# EAGLE schematic switch (EAGLE 6.5.0)
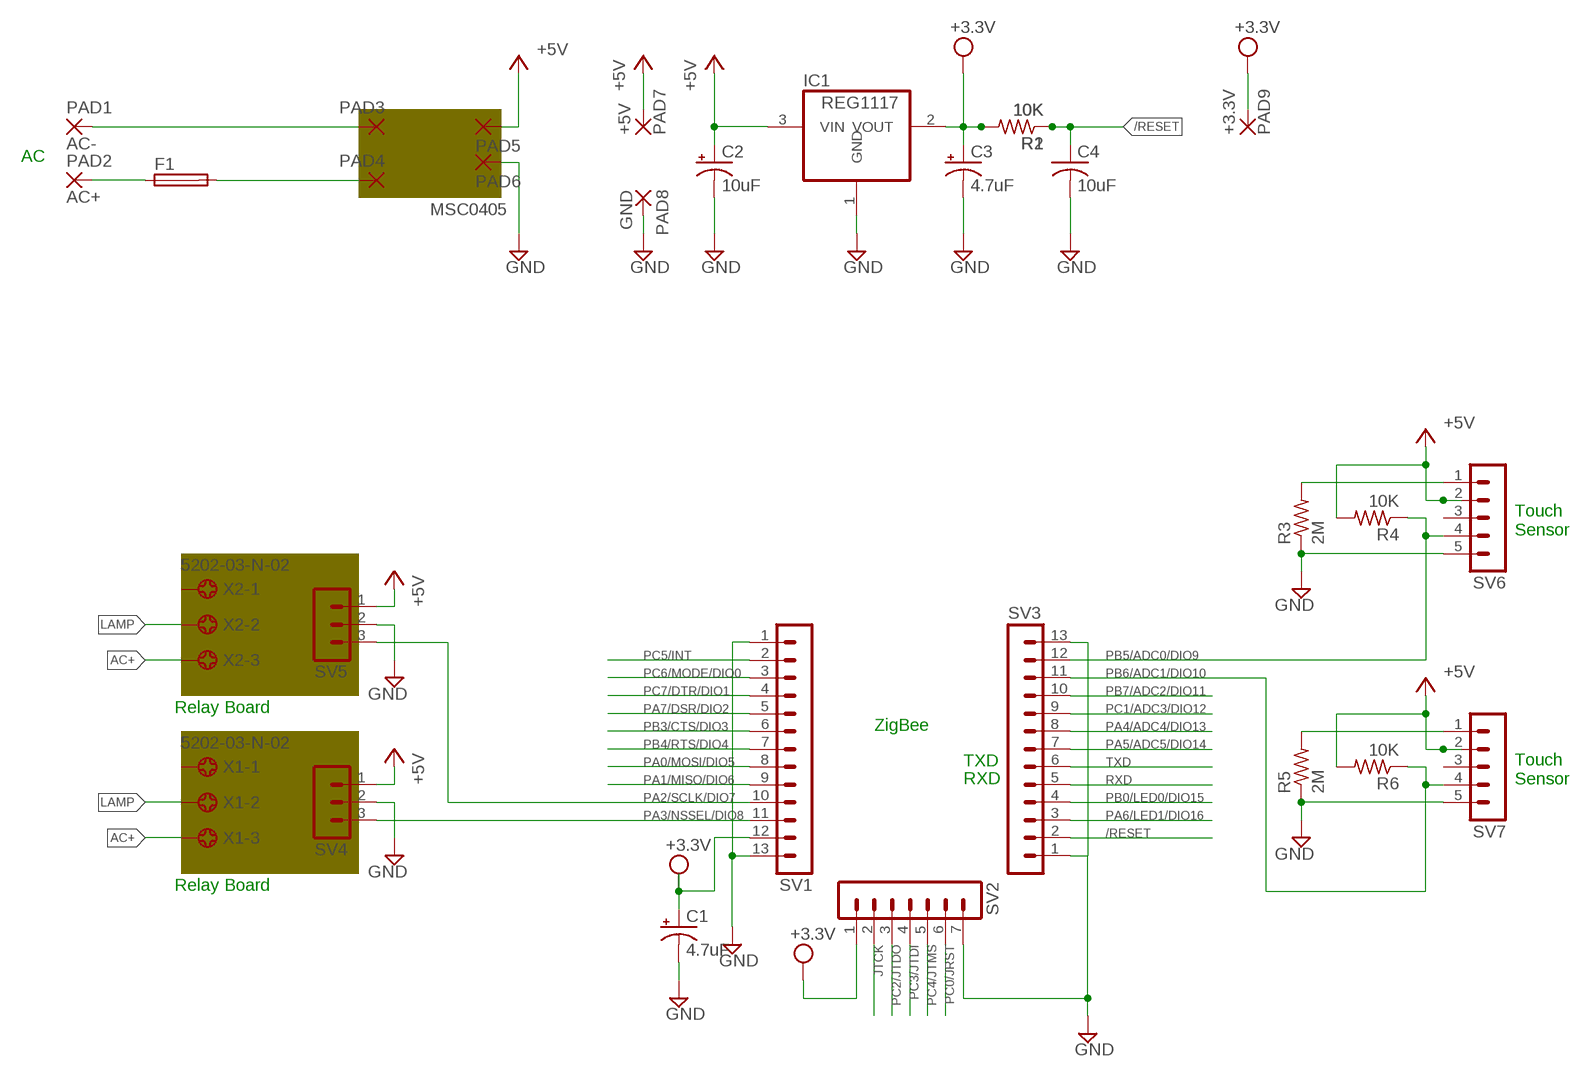
[diagram p0: schematic, sheet 1]

## Parts
C1  4.7uF  CPOL-USSANYO_SMD_A5  [SANYO-OSCON_SMD_A5]
C2  10uF  CPOL-USSANYO_SMD_A5  [SANYO-OSCON_SMD_A5]
C3  4.7uF  CPOL-USSANYO_SMD_A5  [SANYO-OSCON_SMD_A5]
C4  10uF  C-USC1206  [C1206]
F1  GSH15  [GSH15]
IC1  REG1117  [SOT223]
PAD1  AC-  2,54/1,0  [2,54/1,0]
PAD2  AC+  2,54/1,0  [2,54/1,0]
PAD3  2,54/0,8  [2,54/0,8]
PAD4  2,54/0,8  [2,54/0,8]
PAD5  2,54/0,8  [2,54/0,8]
PAD6  2,54/0,8  [2,54/0,8]
PAD7  +5V  2,54/0,8  [2,54/0,8]
PAD8  GND  2,54/0,8  [2,54/0,8]
PAD9  +3.3V  2,54/0,8  [2,54/0,8]
R1  10K  R-US_M1206  [M1206]
R2  10K  R-US_M1206  [M1206]
R3  2M  R-US_M1206  [M1206]
R4  10K  R-US_M1206  [M1206]
R5  2M  R-US_M1206  [M1206]
R6  10K  R-US_M1206  [M1206]
SV1  MA13-1  [MA13-1]
SV2  MA07-1  [MA07-1]
SV3  MA13-1  [MA13-1]
SV4  MA03-1  [MA03-1]
SV5  MA03-1  [MA03-1]
SV6  MA05-1  [MA05-1]
SV7  MA05-1  [MA05-1]
X1  5202-03-N-02  [5202-03-N-02]
X2  5202-03-N-02  [5202-03-N-02]

## Nets
+5V: C2.+ IC1.3(VIN) PAD5.1(P) PAD7.1(P) R4.2 R6.2 SV4.1 SV5.1 SV6.2 SV7.2
/RESET: C4.1 R1.1 R2.1 SV3.2
AC+: X1.3 X2.3
GND: C1.- C2.- C3.- C4.2 IC1.1(GND) PAD6.1(P) PAD8.1(P) R3.1 R5.1 SV1.1 SV1.13 SV2.7 SV3.1 SV3.13 SV4.2 SV5.2 SV6.5 SV7.5
JTCK: SV2.2
LAMP: X1.2 X2.2
N$1: PAD1.1(P) PAD3.1(P)
N$2: F1.1 PAD2.1(P)
N$3: F1.2 PAD4.1(P)
N$4: R3.2 SV6.1
N$6: R5.2 SV7.1
PA0/MOSI/DIO5: SV1.8
PA1/MISO/DIO6: SV1.9
PA2/SCLK/DIO7: SV1.10 SV5.3
PA3/NSSEL/DIO8: SV1.11 SV4.3
PA4/ADC4/DIO13: SV3.8
PA5/ADC5/DIO14: SV3.7
PA6/LED1/DIO16: SV3.3
PA7/DSR/DIO2: SV1.5
PB0/LED0/DIO15: SV3.4
PB3/CTS/DIO3: SV1.6
PB4/RTS/DIO4: SV1.7
PB5/ADC0/DIO9: R4.1 SV3.12 SV6.4
PB6/ADC1/DIO10: R6.1 SV3.11 SV7.4
PB7/ADC2/DIO11: SV3.10
PC0/JRST: SV2.6
PC1/ADC3/DIO12: SV3.9
PC2/JTDO: SV2.3
PC3/JTDI: SV2.4
PC4/JTMS: SV2.5
PC5/INT: SV1.2
PC6/MODE/DIO0: SV1.3
PC7/DTR/DIO1: SV1.4
RXD: SV3.5
TXD: SV3.6
VCC: C1.+ C3.+ IC1.2(VOUT) PAD9.1(P) R1.2 R2.2 SV1.12 SV2.1 ; supply symbol labelled +3.3V
Unconnected: SV6.3 SV7.3 X1.1 X2.1

## Notes on the sheet
- AC
- MSC0405
- Touch
  Sensor
- Relay Board
- ZigBee
- TXD
- RXD
- Touch
  Sensor
- Relay Board

## Library data of the parts
C1-C3 = rcl:CPOL-US: POLARIZED CAPACITOR, American symbol
C4 = rcl:C-US: CAPACITOR, American symbol
F1 = fuse:GSH15: FUSE HOLDER grid 15mm, 19649 Wickmann; MPN: 64900001039; OC_FARNELL: 1271673; OC_NEWARK: 02P0318
IC1 = burr-brown:REG1117: 800mA and 1A Low Dropout (LDO) Positive Regulator 1.8V, 2.5V, 2.85V, 3.3V, 5V, and Adj; MPN: REG1117; OC_FARNELL: 1097566; OC_NEWARK: 14P6981
PAD1 PAD2 = wirepad:2,54/1,0: THROUGH-HOLE PAD
PAD3-PAD9 = wirepad:2,54/0,8: THROUGH-HOLE PAD
R1-R6 = rcl:R-US_: RESISTOR, American symbol
SV1 SV3 = con-lstb:MA13-1: PIN HEADER; OC_FARNELL: unknown; OC_NEWARK: unknown
SV2 = con-lstb:MA07-1: PIN HEADER; OC_FARNELL: unknown; OC_NEWARK: unknown
SV4 SV5 = con-lstb:MA03-1: PIN HEADER; OC_FARNELL: unknown; OC_NEWARK: unknown
SV6 SV7 = con-lstb:MA05-1: PIN HEADER; OC_FARNELL: unknown; OC_NEWARK: unknown
X1 X2 = con-ebyelectro:5202-03-N-02: Barrier Blocks Sreies 5202 Source: http://www.ebyelectro.com/PDF/5202-XX-N-02.pdf; OC_FARNELL: unknown; OC_NEWARK: unknown

## Net classes
1 vcc: width 0.254 mm